# EAGLE schematic Trd_pcb (EAGLE 9.6.2)
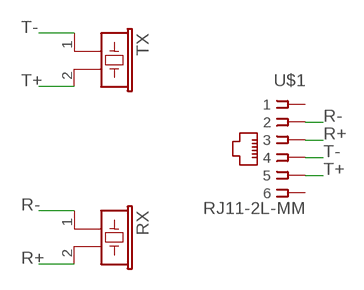
[diagram p0: schematic, sheet 1]

## Parts
RX  EFBAA40D101  [EFBAA40D101]
TX  EFBAA40D101  [EFBAA40D101]
U$1  RJ11-2L-MM  [RJ11-NO_SHIELD_2]

## Nets
R+: RX.2 U$1.3
R-: RX.1 U$1.2
T+: TX.2 U$1.5
T-: TX.1 U$1.4
Unconnected: U$1.1 U$1.6

## Library data of the parts
RX TX = buzzer:EFB?: Piezoelectric Acoustic Transducer Source: Panbasonic .. 2SC1685.pdf; OC_FARNELL: unknown; OC_NEWARK: unknown
U$1 = RJ11_RSA:RJ11-2L-MM